# Altium schematic sheet Output Driver.SchDoc
size A4
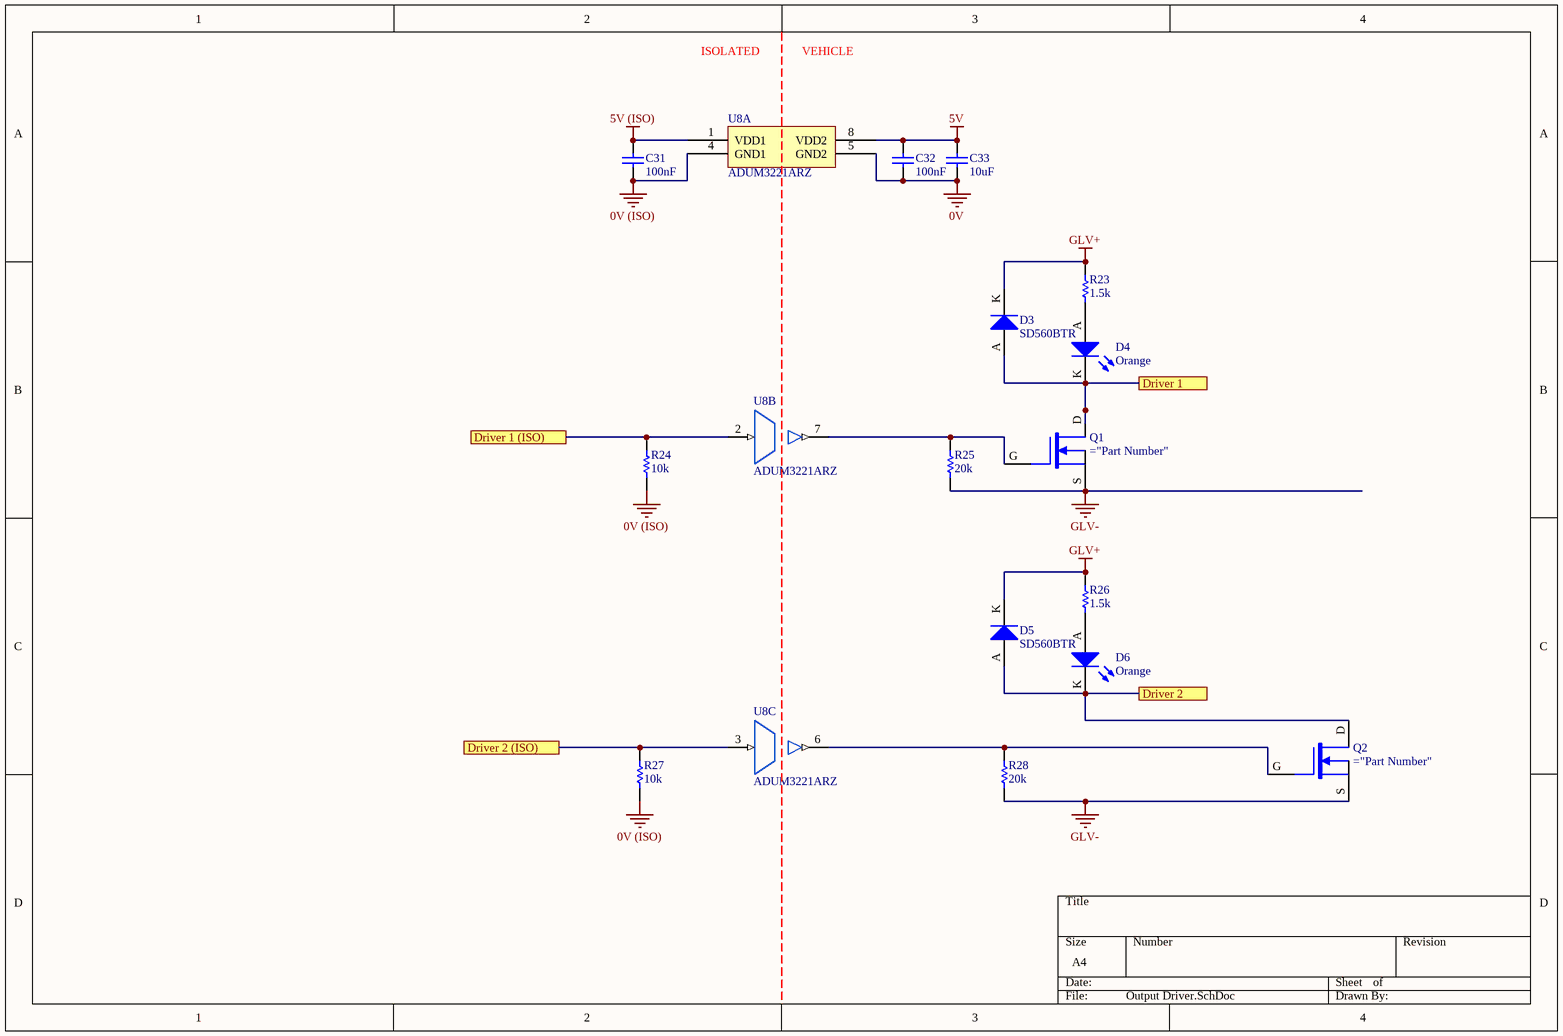
[diagram p0: Output Driver.SchDoc]

## Parts
C31  100nF  [0805]
C32  100nF  [0805]
C33  10uF  [0805]
D3  SD560BTR  [SMB Diode]
D4  Orange  [0805 LED]
D5  SD560BTR  [SMB Diode]
D6  Orange  [0805 LED]
Q1  (no value)  [SOT-343_N]
Q2  (no value)  [SOT-343_N]
R23  1.5k  [0805]
R24  10k  [0805]
R25  20k  [0805]
R26  1.5k  [0805]
R27  10k  [0805]
R28  20k  [0805]
U8  ADUM3221ARZ  [AD 8-SOIC]  (parts A,B,C of 3)

## Ports
Driver 1, Driver 1 (ISO), Driver 2, Driver 2 (ISO)

## Nets
0V: C32.1 C33.1 U8.5(GND2)
0V (ISO): C31.1 R24.1 R27.1 U8.4(GND1)
5V: C32.2 C33.2 U8.8(VDD2)
5V (ISO): C31.2 U8.1(VDD1)
GLV+: D3.K D5.K R23.2 R26.2
GLV-: Q1.S Q2.S R25.1 R28.1
Driver 1: D3.A D4.K Q1.D ; port Driver 1
Driver 1 (ISO): R24.2 U8.2(VIA) ; port Driver 1 (ISO)
Driver 2: D5.A D6.K Q2.D ; port Driver 2
Driver 2 (ISO): R27.2 U8.3(VIA) ; port Driver 2 (ISO)
NetD4_A: D4.A R23.1
NetD6_A: D6.A R26.1
NetQ1_G: Q1.G R25.2 U8.7(VOA)
NetQ2_G: Q2.G R28.2 U8.6(VOA)

## Notes on the sheet
- ISOLATED
- VEHICLE

## Library data of the parts
C31 C32 = GCM21BR71E104KA37L: Manufacturer: muRata; Tolerance: 10%; Material: X7R; Rated Voltage: 25V; Part Number: GCM21BR71E104KA37L; Value: 100nF
C33 = GRM21BR6YA106KE43L: Manufacturer: muRata; Tolerance: 10%; Material: X5R; Rated Voltage: 50V; Part Number: GRM21BR6YA106KE43L; Value: 10uF; Digikey Part Number: 490-10514-6-ND
D3 D5 = SD560BTR: 1.2V_F 600V 5A SMB; Manufacturer: SMC Diode Solutions; Part Number: SD560BTR; Digikey Part Number: 1655-1530-2-ND; Digikey Link: https://www.digikey.com/product-detail/en/smc-diode-solutions/SD560BTR/1655-1530-2-ND/6022620
D4 D6 = SML-211DTT86: Orange LED Indication - Discrete 1.75V 0805 (2012 Metric); Manufacturer: ROHM Semiconductor; Part Number: SML-211DTT86; Colour: Orange; Digikey Part Number: 511-1291-1-ND; Digikey Link: https://www.digikey.com/product-detail/en/rohm-semiconductor/SML-211DTT86/511-1291-1-ND/637104
Q1 Q2 = MOSFET-N: Published: 24-Mar-1999; LatestRevisionDate: 29-May-2009; LatestRevisionNote: IPC-7351 Footprint Added.; PackageVersion: Sep-2000; PackageReference: SOT-343; Publisher: Altium Limited; PackageDescription: 4-Pin SOT-343 Package 1.3 mm Pitch, 2.1 mm Lead Span
R23 R26 = RC0805FR071K5L: Manufacturer: YAGEO; Tolerance: 0.01; Rated Voltage: 0.125W; Part Number: RC0805FR071K5L; Value: 1.5k; Material: FR-07; Digikey Part Number: 311-1.50KCRCT-ND
R24 R27 = RC0805FR0710KL: Manufacturer: YAGEO; Tolerance: 0.01; Rated Voltage: 0.125W; Part Number: RC0805FR0710KL; Value: 10k; Material: FR-07; Digikey Part Number: 311-10.0KCRCT-ND
R25 R28 = RC0805FR0720KL: Manufacturer: YAGEO; Tolerance: 0.01; Rated Voltage: 0.125W; Part Number: RC0805FR0720KL; Value: 20k; Material: FR-07; Digikey Part Number: 311-20.0KCRCT-ND
U8 = ADUM3221ARZ: 4A Gate Driver Magnetic Coupling 2500Vrms 2 Channel 8-SOIC; Manufacturer: Analog Devices; Part Number: ADUM3221ARZ; Digikey Part Number: ADUM3221ARZ-ND; Digikey Link: https://www.digikey.com/product-detail/en/analog-devices-inc/ADUM3221ARZ/ADUM3221ARZ-ND/2616333